# Altium schematic sheet PS2 CONECTOR.SchDoc
size A
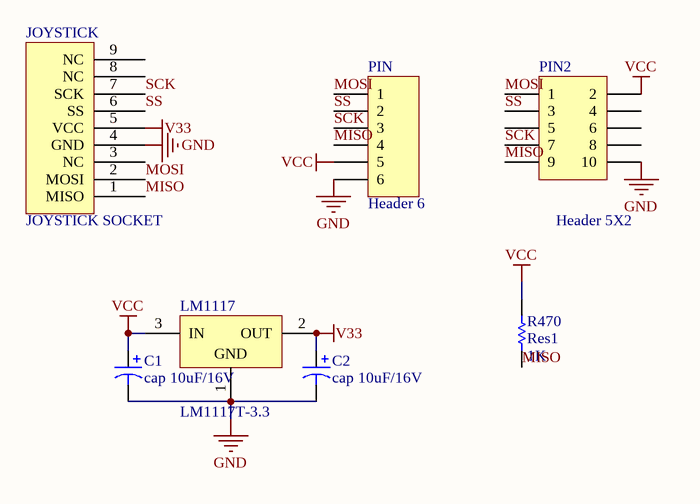
[diagram p0: PS2 CONECTOR.SchDoc]

## Parts
C1  cap 10uF/16V  [cap 10uF/16V]
C2  cap 10uF/16V  [cap 10uF/16V]
JOYSTICK  JOYSTICK SOCKET  [JOY SOCKET]
LM1117  LM1117T-3.3  [T03B]
PIN  Header 6  [HDR1X6]
PIN2  Header 5X2  [HDR2X5]
R470  Res1  value 1K  [AXIAL-0.3]

## Nets
GND: C1.2 C2.2 JOYSTICK.4(GND) LM1117.1(GND) PIN.6 PIN2.10
V33: C2.1 JOYSTICK.5(VCC) LM1117.2(OUT)
VCC: C1.1 LM1117.3(IN) PIN.5 PIN2.2 R470.2
MISO: JOYSTICK.1(MISO) PIN.4 PIN2.9 R470.1
MOSI: JOYSTICK.2(MOSI) PIN.1 PIN2.1
SCK: JOYSTICK.7(SCK) PIN.3 PIN2.7
SS: JOYSTICK.6(SS) PIN.2 PIN2.3

Not connected (* = marked no-connect by the designer): JOYSTICK 3(NC) 8(NC) 9(NC); PIN2 4 5 6 8

## Library data of the parts
JOYSTICK = Socket joystick
LM1117 = LM1117T-3.3: 800mA Low-Dropout Linear Regulator, 3-pin TO-220; Manufacturer: National Semiconductor; PackageTopMarking: NSUZXYTTE#*LM1117T*3.3; PowerWise: N; CompType: LDO IC; Published: 4-Dec-2008; DatasheetVersion: Apr-2006; PackageVersion: revL, Jan-1992; PackageReference: T03B; Publisher: Altium Limited; PackageDescription: TO-220, Molded, 3 Lead, Straight; Supplier 1: Farnell; Supplier Part Number 1: 9485813; PartNumber: LM1117T-3.3; RoHS: N; PinCount: 3; ComponentLink1Description: LM1117 Datasheet; ComponentLink1URL: http://www.national.com/ds/LM/LM1117.pdf; ComponentLink2Description: LM1117 Web Page; ComponentLink2URL: http://www.national.com/pf/LM/LM1117.html; ComponentLink3Description: T03B Package Page; ComponentLink3URL: http://www.national.com/packaging/folders/t03b.html
PIN = Header 6: Header, 6-Pin; LatestRevisionDate: 17-Jul-2002; LatestRevisionNote: Re-released for DXP Platform.; Publisher: Altium Limited
PIN2 = Header 5X2: Header, 5-Pin, Dual row; LatestRevisionDate: 17-Jul-2002; LatestRevisionNote: Re-released for DXP Platform.; Publisher: Altium Limited
R470 = Res1: Resistor; Published: 8-Jun-2000; LatestRevisionDate: 17-Jul-2002; LatestRevisionNote: Re-released for DXP Platform.; PackageReference: AXIAL-0.3; Publisher: Altium Limited